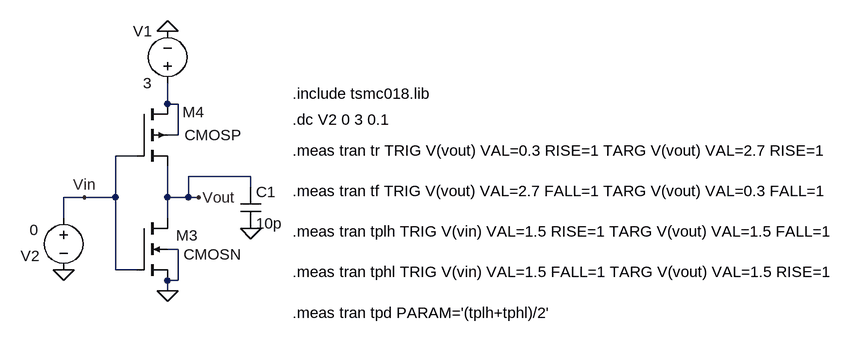
[diagram p0: schematic CMOS_inverter.asc]
CMOS_inverter.asc, the LTspice schematic file:
Version 4
SHEET 1 1340 680
WIRE 192 48 192 16
WIRE 208 48 192 48
WIRE 208 96 208 48
WIRE 208 96 192 96
WIRE 144 128 112 128
WIRE 320 160 224 160
WIRE 320 176 320 160
WIRE 64 192 32 192
WIRE 112 192 112 128
WIRE 112 192 64 192
WIRE 192 192 192 144
WIRE 224 192 224 160
WIRE 224 192 192 192
WIRE 240 192 224 192
WIRE 32 224 32 192
WIRE 192 224 192 192
WIRE 208 272 192 272
WIRE 112 304 112 192
WIRE 144 304 112 304
WIRE 208 320 208 272
WIRE 208 320 192 320
WIRE 192 336 192 320
FLAG 192 336 0
FLAG 192 -64 0
FLAG 32 304 0
FLAG 240 192 Vout
FLAG 64 192 Vin
FLAG 320 240 0
SYMBOL voltage 192 32 R180
WINDOW 0 24 96 Left 2
WINDOW 3 24 16 Left 2
WINDOW 123 0 0 Left 0
WINDOW 39 0 0 Left 0
SYMATTR InstName V1
SYMATTR Value 3
SYMBOL voltage 32 208 R0
WINDOW 3 -39 34 Right 2
WINDOW 123 0 0 Left 0
WINDOW 39 0 0 Left 0
WINDOW 0 -66 74 Left 2
SYMATTR Value 0
SYMATTR InstName V2
SYMBOL nmos4 144 224 R0
WINDOW 0 61 27 Left 2
WINDOW 3 73 56 Left 2
SYMATTR InstName M3
SYMATTR Value CMOSN
SYMATTR Value2 l=0.18u w=1u
SYMBOL pmos4 144 48 R0
WINDOW 0 71 13 Left 2
WINDOW 3 74 48 Left 2
SYMATTR InstName M4
SYMATTR Value CMOSP
SYMATTR Value2 l=0.18u w=2u
SYMBOL cap 304 176 R0
SYMATTR InstName C1
SYMATTR Value 10p
TEXT 384 120 Left 2 !.meas tran tr TRIG V(vout) VAL=0.3 RISE=1 TARG V(vout) VAL=2.7 RISE=1\n \n.meas tran tf TRIG V(vout) VAL=2.7 FALL=1 TARG V(vout) VAL=0.3 FALL=1\n \n.meas tran tplh TRIG V(vin) VAL=1.5 RISE=1 TARG V(vout) VAL=1.5 FALL=1\n \n.meas tran tphl TRIG V(vin) VAL=1.5 FALL=1 TARG V(vout) VAL=1.5 RISE=1\n \n.meas tran tpd PARAM='(tplh+tphl)/2'
TEXT 384 32 Left 2 !.include tsmc018.lib
TEXT 384 72 Left 2 !.dc V2 0 3 0.1

The netlist it stands for:
* CMOS_inverter.asc
V1 N001 0 3
V2 Vin 0 0
M3 Vout Vin 0 0 CMOSN l=0.18u w=1u
M4 N001 Vin Vout N001 CMOSP l=0.18u w=2u
C1 Vout 0 10p
.model NMOS NMOS
.model PMOS PMOS
.lib standard.mos
.meas tran tr TRIG V(vout) VAL=0.3 RISE=1 TARG V(vout) VAL=2.7 RISE=1
.meas tran tf TRIG V(vout) VAL=2.7 FALL=1 TARG V(vout) VAL=0.3 FALL=1
.meas tran tplh TRIG V(vin) VAL=1.5 RISE=1 TARG V(vout) VAL=1.5 FALL=1
.meas tran tphl TRIG V(vin) VAL=1.5 FALL=1 TARG V(vout) VAL=1.5 RISE=1
.meas tran tpd PARAM='(tplh+tphl)/2'
.include tsmc018.lib
.dc V2 0 3 0.1
.backanno
.end